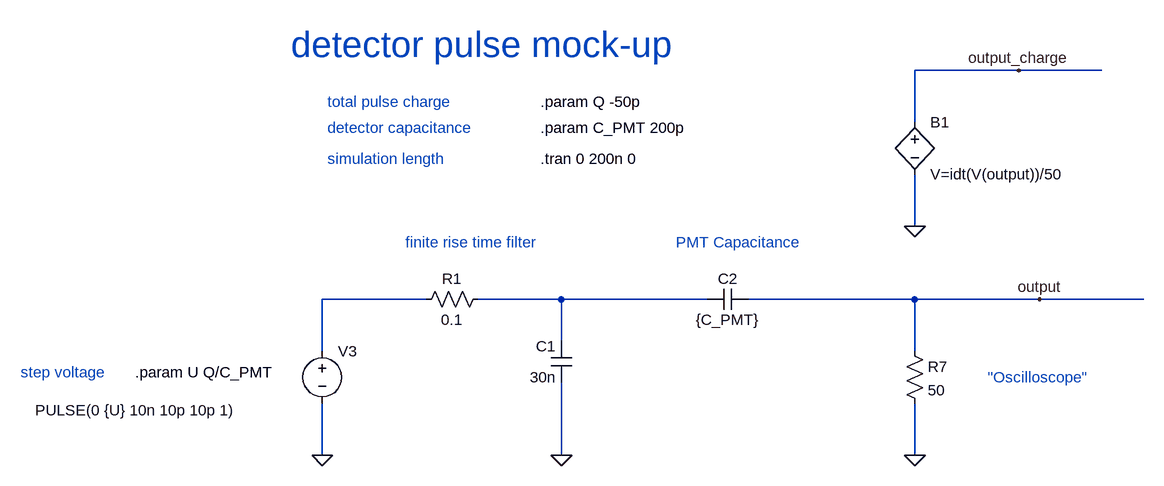
[diagram p0: schematic example.asc]
example.asc, the LTspice schematic file:
Version 4
SHEET 1 880 19840
WIRE -5840 1488 -6000 1488
WIRE -5712 1488 -5840 1488
WIRE -6000 1568 -6000 1488
WIRE -6000 1728 -6000 1648
WIRE -6752 1840 -6912 1840
WIRE -6544 1840 -6672 1840
WIRE -6320 1840 -6544 1840
WIRE -6000 1840 -6256 1840
WIRE -5808 1840 -6000 1840
WIRE -5648 1840 -5808 1840
WIRE -6544 1904 -6544 1840
WIRE -6912 1920 -6912 1840
WIRE -6000 1920 -6000 1840
WIRE -6912 2080 -6912 2000
WIRE -6544 2080 -6544 1968
WIRE -6000 2080 -6000 2000
FLAG -6912 2080 0
FLAG -6000 2080 0
FLAG -5808 1840 output
FLAG -6544 2080 0
FLAG -6000 1728 0
FLAG -5840 1488 output_charge
SYMBOL voltage -6912 1904 R0
WINDOW 123 0 0 Left 0
WINDOW 39 0 0 Left 0
WINDOW 3 -442 107 Left 2
SYMATTR InstName V3
SYMATTR Value PULSE(0 {U} 10n 10p 10p 1)
SYMBOL cap -6256 1824 R90
WINDOW 0 0 32 VBottom 2
WINDOW 3 32 32 VTop 2
SYMATTR InstName C2
SYMATTR Value {C_PMT}
SYMBOL res -6016 1904 R0
SYMATTR InstName R7
SYMATTR Value 50
SYMBOL res -6656 1824 R90
WINDOW 0 0 56 VBottom 2
WINDOW 3 32 56 VTop 2
SYMATTR InstName R1
SYMATTR Value 0.1
SYMBOL cap -6528 1968 R180
WINDOW 0 24 56 Left 2
WINDOW 3 24 8 Left 2
SYMATTR InstName C1
SYMATTR Value 30n
SYMBOL bv -6000 1552 R0
SYMATTR InstName B1
SYMATTR Value V=idt(V(output))/50
TEXT -6576 1624 Left 2 !.tran 0 200n 0
TEXT -5888 1960 Left 2 ;"Oscilloscope"
TEXT -6368 1752 Left 2 ;PMT Capacitance
TEXT -6784 1752 Left 2 ;finite rise time filter
TEXT -6960 1448 Left 5 ;detector pulse mock-up
TEXT -6904 1536 Left 2 ;total pulse charge
TEXT -6576 1536 Left 2 !.param Q -50p
TEXT -6904 1576 Left 2 ;detector capacitance
TEXT -6576 1576 Left 2 !.param C_PMT 200p
TEXT -7376 1952 Left 2 ;step voltage
TEXT -7200 1952 Left 2 !.param U Q/C_PMT
TEXT -6904 1624 Left 2 ;simulation length

The netlist it stands for:
* example.asc
V3 N001 0 PULSE(0 {U} 10n 10p 10p 1)
C2 output N002 {C_PMT}
R7 output 0 50
R1 N002 N001 0.1
C1 0 N002 30n
B1 output_charge 0 V=idt(V(output))/50
.tran 0 200n 0
* "Oscilloscope"
* PMT Capacitance
* finite rise time filter
* detector pulse mock-up
* total pulse charge
.param Q -50p
* detector capacitance
.param C_PMT 200p
* step voltage
.param U Q/C_PMT
* simulation length
.backanno
.end

* Results of the author's LTspice run, read from the files saved beside the schematic
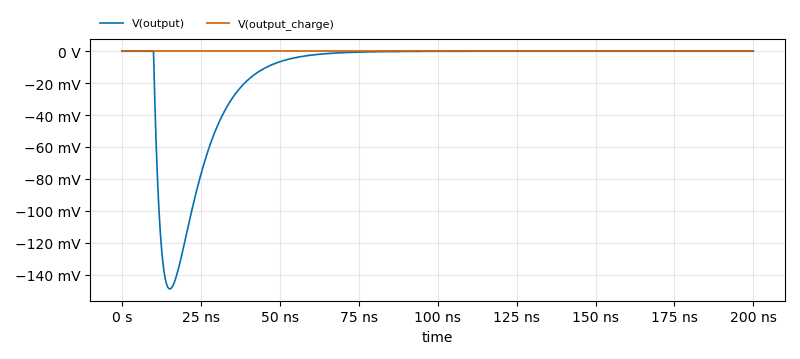
[diagram p1: Transient Analysis of example.asc, plotted from the saved traces]
* Transient Analysis, 1 run:
*   V(output): min -149 mV, max 0 V, average -12.5 mV, rms 34.63 mV, last 0 V
*   V(output_charge): min -50 pV, max 0 V, average -44.19 pV, rms 46.29 pV, last -50 pV